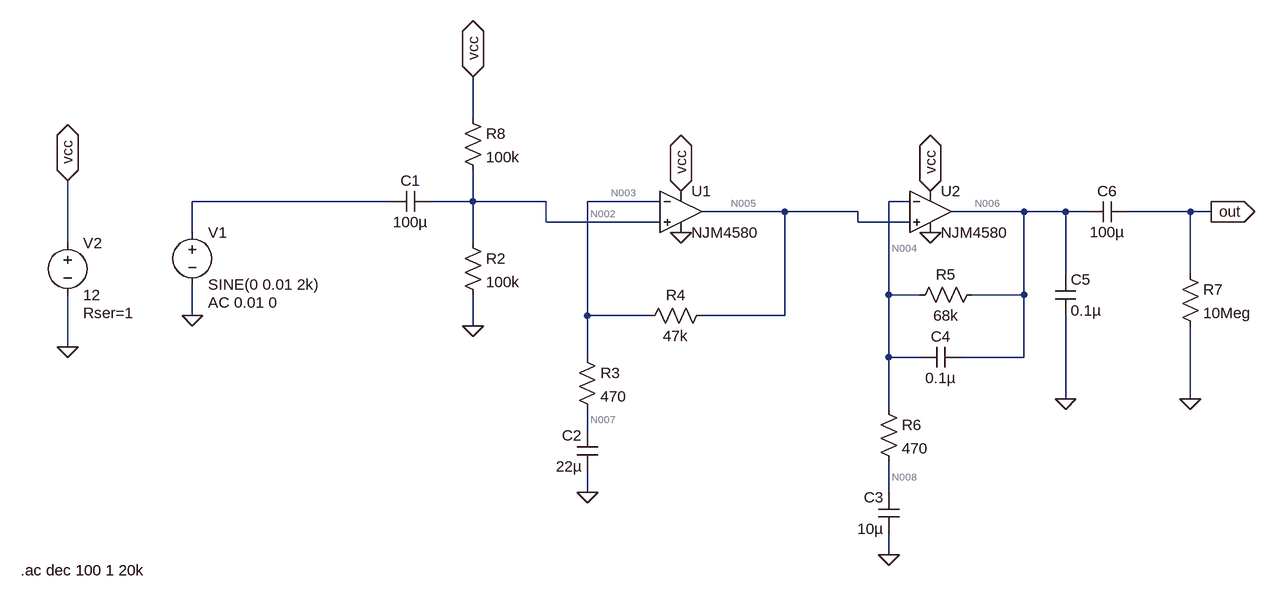
[diagram p0: schematic dynamic_micamp_ltspice.asc]
dynamic_micamp_ltspice.asc, the LTspice schematic file:
Version 4
SHEET 1 1392 728
WIRE 160 -96 160 -160
WIRE 32 32 -272 32
WIRE 160 32 160 -16
WIRE 160 32 96 32
WIRE 272 32 160 32
WIRE 448 32 336 32
WIRE 832 32 800 32
WIRE 640 48 512 48
WIRE 752 48 640 48
WIRE 1008 48 896 48
WIRE 1072 48 1008 48
WIRE 1104 48 1072 48
WIRE 1264 48 1168 48
WIRE 1296 48 1264 48
WIRE 272 64 272 32
WIRE 448 64 272 64
WIRE 752 64 752 48
WIRE 832 64 752 64
WIRE -272 80 -272 32
WIRE -464 96 -464 0
WIRE 160 96 160 32
WIRE 1072 144 1072 48
WIRE 1264 144 1264 48
WIRE 800 176 800 32
WIRE 848 176 800 176
WIRE 1008 176 1008 48
WIRE 1008 176 928 176
WIRE -272 208 -272 160
WIRE 336 208 336 32
WIRE 432 208 336 208
WIRE 640 208 640 48
WIRE 640 208 512 208
WIRE 160 224 160 176
WIRE -464 256 -464 176
WIRE 336 272 336 208
WIRE 800 272 800 176
WIRE 848 272 800 272
WIRE 1008 272 1008 176
WIRE 1008 272 912 272
WIRE 1072 336 1072 208
WIRE 1264 336 1264 224
WIRE 800 352 800 272
WIRE 336 384 336 352
WIRE 336 480 336 448
WIRE 800 480 800 432
WIRE 800 576 800 544
FLAG 800 576 0
FLAG 1072 336 0
FLAG 336 480 0
FLAG 160 224 0
FLAG 1296 48 out
IOPIN 1296 48 Out
FLAG 1264 336 0
FLAG -464 256 0
FLAG -464 0 vcc
IOPIN -464 0 BiDir
FLAG 480 16 vcc
IOPIN 480 16 BiDir
FLAG 864 16 vcc
IOPIN 864 16 BiDir
FLAG 864 80 0
FLAG 480 80 0
FLAG -272 208 0
FLAG 160 -160 vcc
IOPIN 160 -160 BiDir
SYMBOL cap 96 16 R90
WINDOW 0 0 32 VBottom 2
WINDOW 3 32 32 VTop 2
SYMATTR InstName C1
SYMATTR Value 100µ
SYMBOL cap 352 448 R180
WINDOW 0 24 56 Left 2
WINDOW 3 24 8 Left 2
SYMATTR InstName C2
SYMATTR Value 22µ
SYMBOL cap 816 544 R180
WINDOW 0 24 56 Left 2
WINDOW 3 24 8 Left 2
SYMATTR InstName C3
SYMATTR Value 10µ
SYMBOL cap 848 288 R270
WINDOW 0 32 32 VTop 2
WINDOW 3 0 32 VBottom 2
SYMATTR InstName C4
SYMATTR Value 0.1µ
SYMBOL cap 1056 144 R0
SYMATTR InstName C5
SYMATTR Value 0.1µ
SYMBOL cap 1168 32 R90
WINDOW 0 0 32 VBottom 2
WINDOW 3 32 32 VTop 2
SYMATTR InstName C6
SYMATTR Value 100µ
SYMBOL res 144 80 R0
SYMATTR InstName R2
SYMATTR Value 100k
SYMBOL res 320 256 R0
SYMATTR InstName R3
SYMATTR Value 470
SYMBOL res 528 192 R90
WINDOW 0 0 56 VBottom 2
WINDOW 3 32 56 VTop 2
SYMATTR InstName R4
SYMATTR Value 47k
SYMBOL res 944 160 R90
WINDOW 0 0 56 VBottom 2
WINDOW 3 32 56 VTop 2
SYMATTR InstName R5
SYMATTR Value 68k
SYMBOL res 784 336 R0
SYMATTR InstName R6
SYMATTR Value 470
SYMBOL res 1248 128 R0
SYMATTR InstName R7
SYMATTR Value 10Meg
SYMBOL voltage -464 80 R0
WINDOW 123 0 0 Left 0
WINDOW 39 24 124 Left 2
SYMATTR InstName V2
SYMATTR Value 12
SYMATTR SpiceLine Rser=1
SYMBOL voltage -272 64 R0
WINDOW 123 24 124 Left 2
WINDOW 39 0 0 Left 0
SYMATTR InstName V1
SYMATTR Value SINE(0 0.01 2k)
SYMATTR Value2 AC 0.01 0
SYMBOL Opamps\\NJM4580 480 -16 R0
SYMATTR InstName U1
SYMBOL Opamps\\NJM4580 864 -16 R0
SYMATTR InstName U2
SYMBOL res 144 -112 R0
SYMATTR InstName R8
SYMATTR Value 100k
TEXT -536 600 Left 2 !.ac dec 100 1 20k

The netlist it stands for:
* dynamic_micamp_ltspice.asc
C1 N002 N001 100µ
C2 0 N007 22µ
C3 0 N008 10µ
C4 N004 N006 0.1µ
C5 N006 0 0.1µ
C6 out N006 100µ
R2 N002 0 100k
R3 N003 N007 470
R4 N005 N003 47k
R5 N006 N004 68k
R6 N004 N008 470
R7 out 0 10Meg
V2 vcc 0 12 Rser=1
V1 N001 0 SINE(0 0.01 2k) AC 0.01 0
XU1 N002 N003 vcc 0 N005 NJM4580  ; pins In+ In- V+ V- OUT
XU2 N005 N004 vcc 0 N006 NJM4580  ; pins In+ In- V+ V- OUT
R8 vcc N002 100k
.ac dec 100 1 20k
.backanno
.end

* Results of the author's LTspice run, read from the files saved beside the schematic
* Operating Point, zero values left out:
*   V(n002) = 6.002 V
*   V(n007) = 6.002 V
*   V(n008) = 5.997 V
*   V(n004) = 5.997 V
*   V(n006) = 5.99 V
*   V(n003) = 6.002 V
*   V(n005) = 5.997 V
*   V(vcc) = 11.99 V
*   I(R8) = 59.93 µA
*   I(R5) = -99.63 nA
*   I(R4) = -99.63 nA
*   I(R2) = 60.02 µA
*   I(V2) = -5.398 mA
*   Ix(u1:1) = -93.67 nA
*   Ix(u1:2) = -99.63 nA
*   Ix(u1:3) = 2.669 mA
*   Ix(u1:4) = -2.635 mA
*   Ix(u1:5) = 193.3 nA
*   Ix(u2:1) = -93.68 nA
*   Ix(u2:2) = -99.63 nA
*   Ix(u2:3) = 2.669 mA
*   Ix(u2:4) = -2.635 mA
*   Ix(u2:5) = 99.63 nA
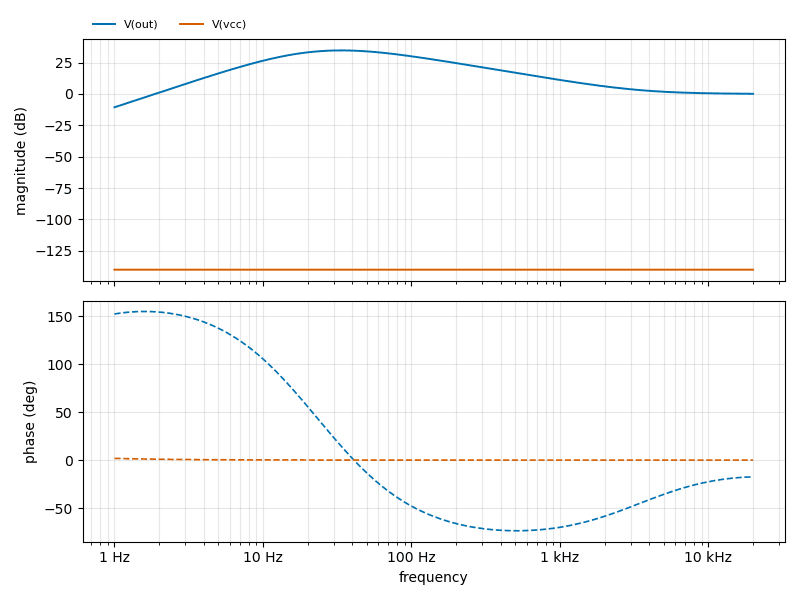
[diagram p1: AC Analysis of dynamic_micamp_ltspice.asc, plotted from the saved traces]
* AC Analysis, 1 run:
*   V(out): -10.61 dB at 1 Hz, 0.13 dB at 20 kHz, peak 34.71 dB at 33.88 Hz, 3 dB below the peak at 16.3 Hz and 77.94 Hz
*   V(vcc): -140.01 dB at 1 Hz, -140.00 dB at 20 kHz, peak -140.00 dB at 38.02 Hz